# Altium schematic sheet Sheet_ElectricMeter_1Phase.SchDoc
size A4; SheetNumber: 1; SheetTotal: 1
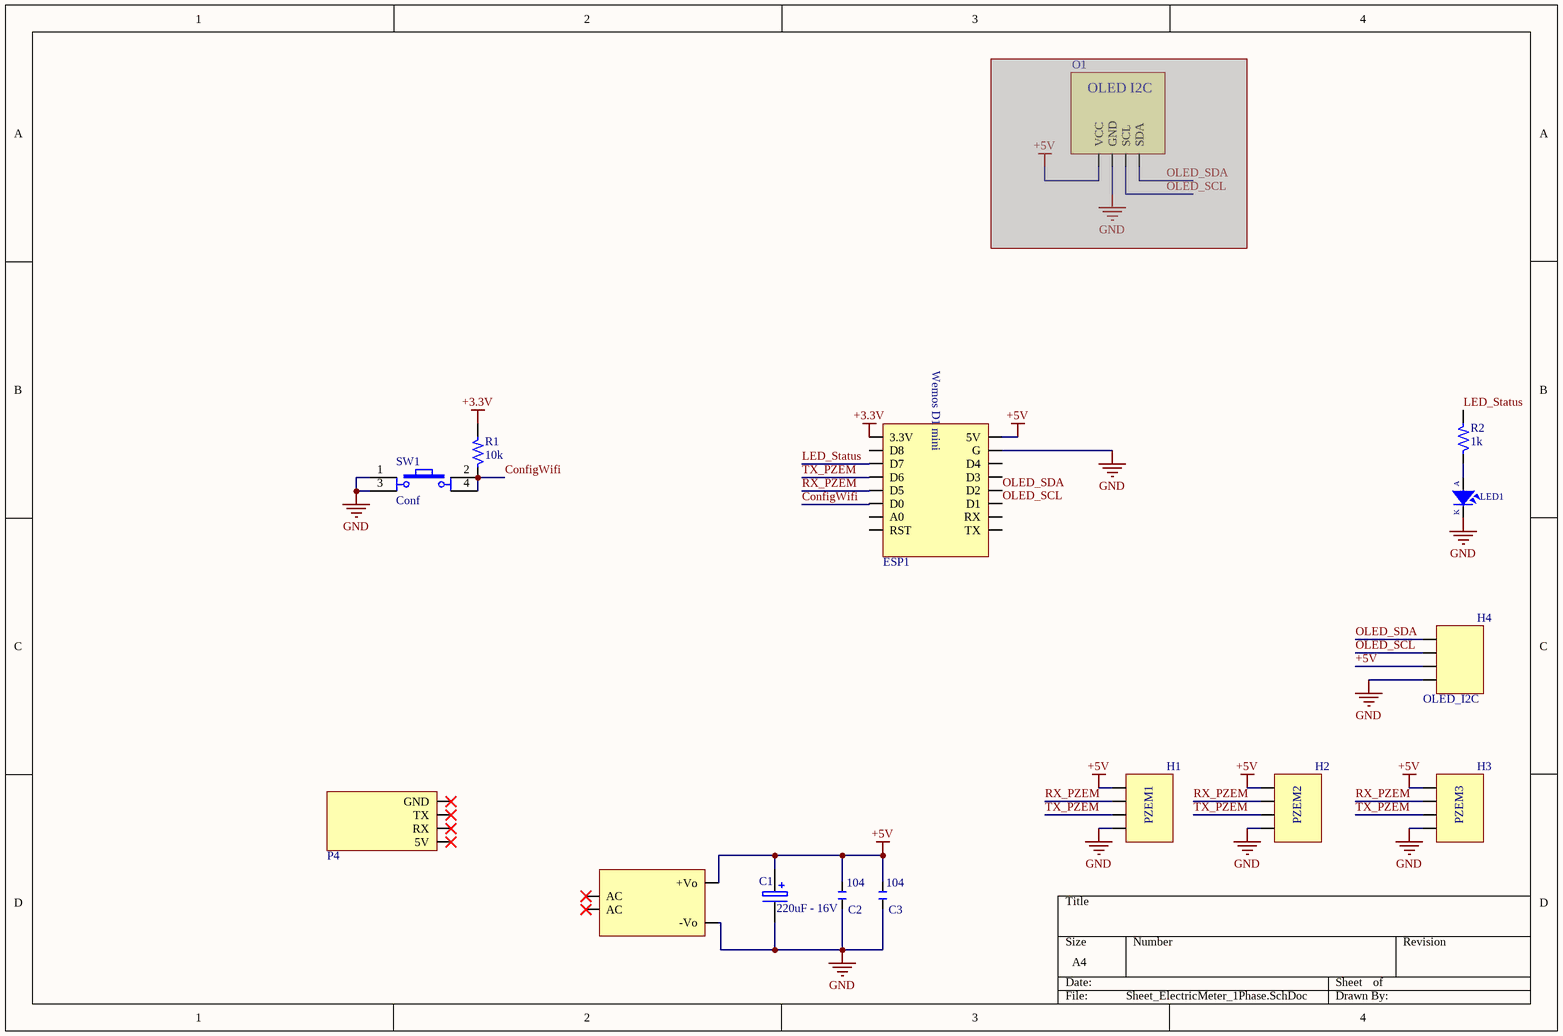
[diagram p0: Sheet_ElectricMeter_1Phase.SchDoc]

## Parts
1  Hi Link 3W  [Hi Link 3W]  (value not drawn)
C1  220uF - 16V  [CP1/2.5]
C2  104  [Cap 104 5mm]
C3  104  [Cap 104 5mm]
ESP1  Esp8266 D1 Mini  [ESP8266 D1 mini]  (value not drawn)
H1  PZEM1  [Header 4P 2.54]
H2  PZEM2  [Header 4P 2.54]
H3  PZEM3  [Header 4P 2.54]
H4  OLED_I2C  [Header 4P 2.54]
LED1  LED  [LED-5-Yellow]  (value not drawn)
O1  OLED I2C  [OLED 0.96 AM Cao]  (value not drawn)  (masked out: inside a compile mask, not in the netlist)
P4  pzem 004t power sine  [PZEM004T High]  (value not drawn)
R1  10k  [R1/4W]
R2  1k  [R1/4W]
SW1  Conf  [SW4]

## Nets
+3.3V: ESP1.8(3.3V) R1.2
+5V: 1.4(+Vo) C1.1 C2.2 C3.2 ESP1.9(5V) H1.1 H2.1 H3.1 H4.3
GND: 1.3(-Vo) C1.2 C2.1 C3.1 ESP1.10(G) H1.4 H2.4 H3.4 H4.4 LED1.2(K) SW1.1 SW1.3
ConfigWifi: ESP1.3(D0) R1.1 SW1.2 SW1.4
LED_Status: ESP1.6(D7) R2.2
OLED_SCL: ESP1.14(D1) H4.2
OLED_SDA: ESP1.13(D2) H4.1
RX_PZEM: ESP1.4(D5) H1.2 H2.2 H3.2
TX_PZEM: ESP1.5(D6) H1.3 H2.3 H3.3
NetLED1_1: LED1.1(A) R2.1

Not connected (* = marked no-connect by the designer): 1 1(AC)* 2(AC)*; ESP1 1(RST) 2(A0) 7(D8) 11(D4) 12(D3) 15(RX) 16(TX); P4 1(5V)* 2(RX)* 3(TX)* 4(GND)*

## Notes on the sheet
- (in symbol Esp8266 D1 Mini) Wemos D1 mini

## Library data of the parts
C1 = CAP hoa: Cap
C2 C3 = CAP
H1-H4 = Header 4P
LED1 = LED: LED Single colour Green and Red
P4 = PZEM
R1 R2 = Res DIP: Res
SW1 = SW4: Switch button 4 pin; Value: Button chip 4 pin